# Altium schematic sheet I2C.SchDoc
size A4
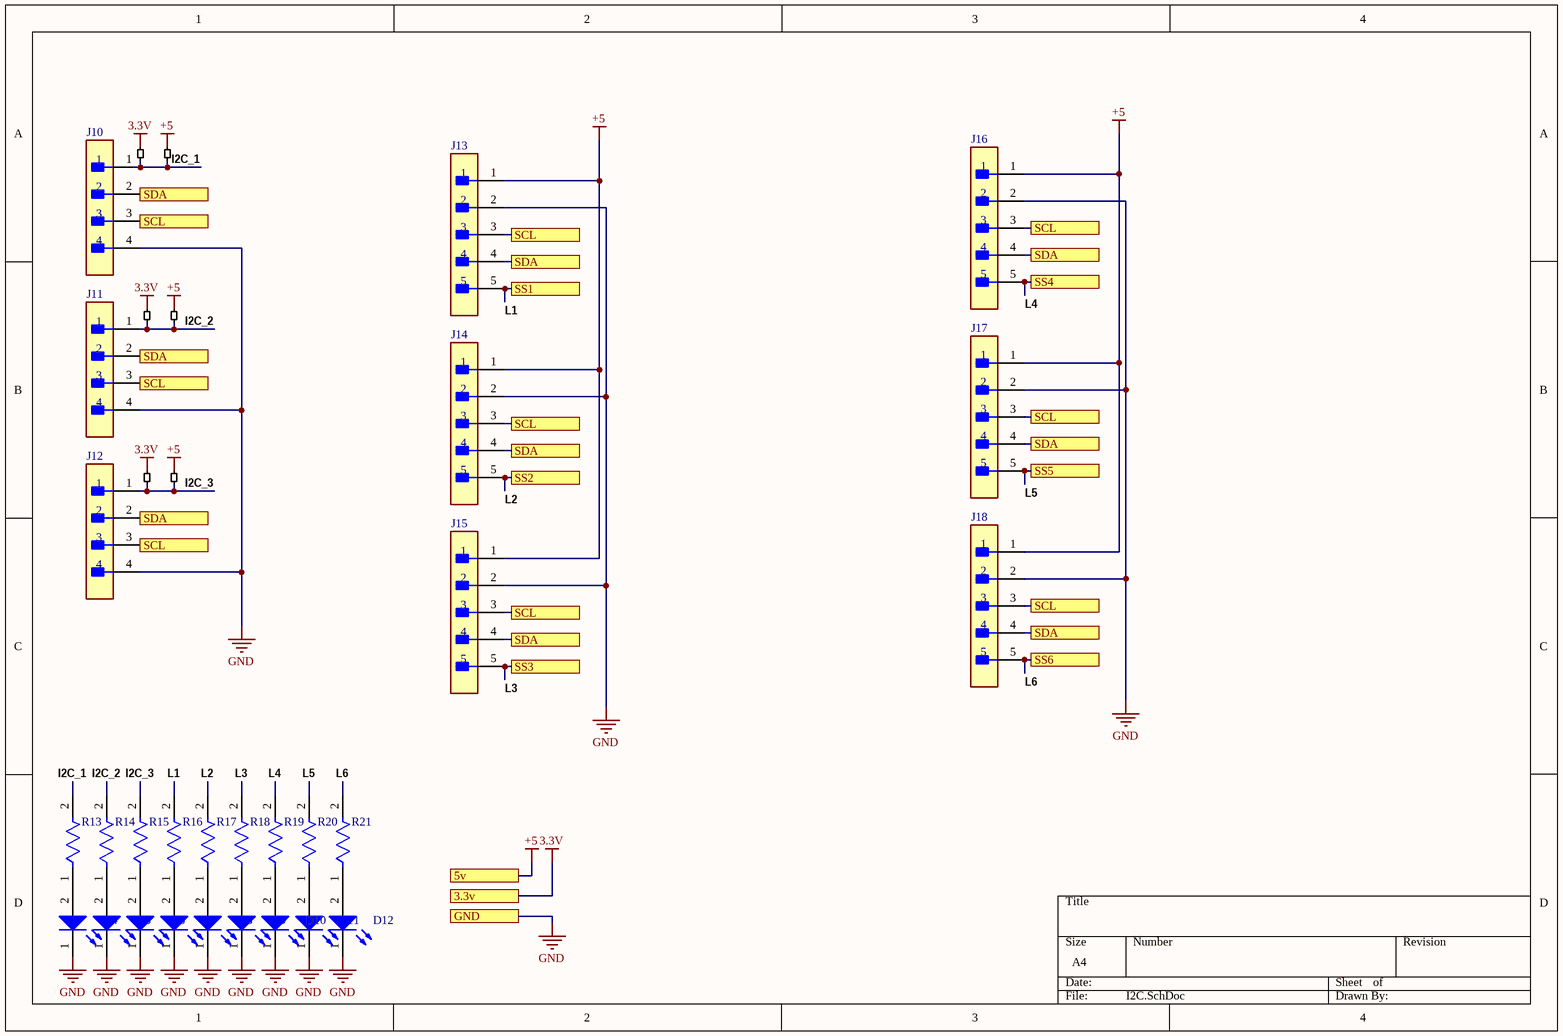
[diagram p0: I2C.SchDoc]

## Parts
D4  150080BS75000  [WL-SMCW_0805_150080xx75000]  (value not drawn)
D5  150080BS75000  [WL-SMCW_0805_150080xx75000]  (value not drawn)
D6  150080BS75000  [WL-SMCW_0805_150080xx75000]  (value not drawn)
D7  150080BS75000  [WL-SMCW_0805_150080xx75000]  (value not drawn)
D8  150080BS75000  [WL-SMCW_0805_150080xx75000]  (value not drawn)
D9  150080BS75000  [WL-SMCW_0805_150080xx75000]  (value not drawn)
D10  150080BS75000  [WL-SMCW_0805_150080xx75000]  (value not drawn)
D11  150080BS75000  [WL-SMCW_0805_150080xx75000]  (value not drawn)
D12  150080BS75000  [WL-SMCW_0805_150080xx75000]  (value not drawn)
J10  B4B-XH-A(LF)(SN)  [FP-B4B-XH-A_LF_SN-MFG]  (value not drawn)
J11  B4B-XH-A(LF)(SN)  [FP-B4B-XH-A_LF_SN-MFG]  (value not drawn)
J12  B4B-XH-A(LF)(SN)  [FP-B4B-XH-A_LF_SN-MFG]  (value not drawn)
J13  B5B-PH-K-S(LF)(SN)  [FP-B5B-PH-K-S_LF_SN-MFG]  (value not drawn)
J14  B5B-PH-K-S(LF)(SN)  [FP-B5B-PH-K-S_LF_SN-MFG]  (value not drawn)
J15  B5B-PH-K-S(LF)(SN)  [FP-B5B-PH-K-S_LF_SN-MFG]  (value not drawn)
J16  B5B-PH-K-S(LF)(SN)  [FP-B5B-PH-K-S_LF_SN-MFG]  (value not drawn)
J17  B5B-PH-K-S(LF)(SN)  [FP-B5B-PH-K-S_LF_SN-MFG]  (value not drawn)
J18  B5B-PH-K-S(LF)(SN)  [FP-B5B-PH-K-S_LF_SN-MFG]  (value not drawn)
R13  ERJ-P06F1001V  [FP-ERJP06-IPC_C]  (value not drawn)
R14  ERJ-P06F1001V  [FP-ERJP06-IPC_C]  (value not drawn)
R15  ERJ-P06F1001V  [FP-ERJP06-IPC_C]  (value not drawn)
R16  ERJ-P06F1001V  [FP-ERJP06-IPC_C]  (value not drawn)
R17  ERJ-P06F1001V  [FP-ERJP06-IPC_C]  (value not drawn)
R18  ERJ-P06F1001V  [FP-ERJP06-IPC_C]  (value not drawn)
R19  ERJ-P06F1001V  [FP-ERJP06-IPC_C]  (value not drawn)
R20  ERJ-P06F1001V  [FP-ERJP06-IPC_C]  (value not drawn)
R21  ERJ-P06F1001V  [FP-ERJP06-IPC_C]  (value not drawn)
W18  Jumper  [Jumper Mid]  (value not drawn)
W19  Jumper  [Jumper Mid]  (value not drawn)
W20  Jumper  [Jumper Mid]  (value not drawn)
W21  Jumper  [Jumper Mid]  (value not drawn)
W22  Jumper  [Jumper Mid]  (value not drawn)
W23  Jumper  [Jumper Mid]  (value not drawn)

## Ports
3.3v, 5v, GND, SCL, SDA, SS1, SS2, SS3, SS4, SS5, SS6

## Nets
3.3V: W18.2 W19.2 W20.2 ; port 3.3v
+5: J13.1 J14.1 J15.1 J16.1 J17.1 J18.1 W21.2 W22.2 W23.2 ; port 5v
GND: D4.1(K) D5.1(K) D6.1(K) D7.1(K) D8.1(K) D9.1(K) D10.1(K) D11.1(K) D12.1(K) J10.4 J11.4 J12.4 J13.2 J14.2 J15.2 J16.2 J17.2 J18.2 ; port GND
I2C_1: J10.1 R13.2 W18.1 W21.1
I2C_2: J11.1 R14.2 W19.1 W22.1
I2C_3: J12.1 R15.2 W20.1 W23.1
L1: J13.5 R16.2 ; port SS1
L2: J14.5 R17.2 ; port SS2
L3: J15.5 R18.2 ; port SS3
L4: J16.5 R19.2 ; port SS4
L5: J17.5 R20.2 ; port SS5
L6: J18.5 R21.2 ; port SS6
SCL: J10.3 J11.3 J12.3 J13.3 J14.3 J15.3 J16.3 J17.3 J18.3 ; port SCL
SDA: J10.2 J11.2 J12.2 J13.4 J14.4 J15.4 J16.4 J17.4 J18.4 ; port SDA
NetD4_2: D4.2(A) R13.1
NetD5_2: D5.2(A) R14.1
NetD6_2: D6.2(A) R15.1
NetD7_2: D7.2(A) R16.1
NetD8_2: D8.2(A) R17.1
NetD9_2: D9.2(A) R18.1
NetD10_2: D10.2(A) R19.1
NetD11_2: D11.2(A) R20.1
NetD12_2: D12.2(A) R21.1

## Library data of the parts
D4-D12 = CMP-1426-00008-6: NexarPartId: 29717779; Test Current: 20mA; Lens Style: Clear, Rectangular; Forward Current: 100mA; Power Dissipation: 105mW; Dominant Wavelength: 470nm; Reverse Voltage: 5V; Viewing Angle: 140°; Luminous Intensity: 145mcd; Color: Blue; Forward Voltage: 3.2V; Max Junction Temperature (Tj): 95°C; Peak Wavelength: 465nm; Min Operating Temperature: -40°C; Mount: Surface Mount; Case Code (Imperial): 0805; Packaging: Tape and Reel; Lead Free: Lead Free; Length: 2mm; Case/Package: 0805; Case Code (Metric): 2012; Max Operating Temperature: 85°C; Height: 700µm; RoHS: Compliant; Max Reverse Voltage (DC): 5V; REACH SVHC: Unknown; Width: 1.25mm; Wavelength: 470nm
J10-J12 = CMP-17439-000250-1: CONN HEADER VERT 4POS 2.5MM; Number of Contacts: 4; Contact Resistance: 20mR; Voltage Rating: 250V; Max Current Rating: 3A; Gender: Male; Wire/Cable Gauge: 22AWG; Mated Stacking Heights: 9.8mm; Insulation Resistance: 1GR; Orientation: Straight; Contact Type: Male Pin; Contact Finish - Mating: TIN; Series: XH; Max Voltage Rating (AC): 250V; Lead Pitch: 2.5mm; Contact Shape: Square; Insulation Color: Natural; Termination: Solder; Lead Free: Lead Free; Voltage Rating (AC): 250V; Number of Rows: 1; Flammability Rating: UL94 V-0; Number of Positions: 4; Max Operating Temperature: 85°C; Package Quantity: 500; Mount: Through Hole; REACH SVHC: No SVHC; Connector Type: Header; Insulation Material: Nylon; Fastening Type: Detent; Min Operating Temperature: -25°C; Housing Color: White; Packaging: Bulk; Contact Plating: Tin; Contact Material: Brass; Max Voltage Rating (DC): 250V; Housing Material: Polyamide; Color: Natural; Material: Polyamide; Pitch: 2.5mm; Depth: 5.75mm; Current Rating: 3A; Length: 12.4mm
J13-J18 = CMP-2000-05908-2: CONN HEADER VERT 5POS 2MM; Voltage Rating (AC): 100V; Number of Positions: 5; Contact Resistance: 20mR; Insulation Resistance: 1MR; Current Rating: 2A; Gender: Male; Mated Stacking Heights: 8mm; Series: PH; Number of Poles: 5; Width: 4.5mm; Insulation Color: Natural; Fastening Type: Detent; Flammability Rating: UL94 V-0; Mount: Through Hole; Lead Free: Lead Free; Number of Rows: 1; REACH SVHC: No SVHC; Max Voltage Rating (AC): 100V; Contact Mating Length: 0.13inch; Contact Plating: Tin; Housing Material: Polyamide; Depth: 4.5mm; Contact Type: Male Pin; Voltage Rating: 100V; Color: Natural; Housing Color: White; Lead Pitch: 2mm; Number of Contacts: 5; Orientation: Straight; Packaging: Bulk; Contact Material: Brass; Pitch: 2mm; Insulation Material: Nylon; Connector Type: Header; Contact Finish - Mating: TIN; Termination: Solder; Number of Pins: 5; Length: 11.9mm; Contact Shape: Square; Max Current Rating: 2A; Working Voltage: 100V; Min Operating Temperature: -25°C; Max Operating Temperature: 85°C; Material: Polyamide; Height: 9.4mm
R13-R21 = CMP-05422-000125-1: RES SMD 1K OHM 1% 1/2W 0805; Temperature Coefficient: 100ppm/°C; Max Power Dissipation: 500mW; Voltage Rating: 150V; Resistance: 1kR; Case Code (Metric): 2012; Max Operating Temperature: 155°C; REACH SVHC: No SVHC; Mount: Surface Mount; Military Standard: Not; Package Quantity: 5000; Series: ERJ; Height: 0.6mm; Radiation Hardening: No; Termination: Tab; Number of Terminations: 2; Length: 2mm; Resistance Tolerance: 1%; Voltage Rating (DC): 150V; Depth: 1.25mm; Construction: Rectangular; Resistor Type: Thick Film; Packaging: Tape and Reel; Contact Plating: Tin; RoHS Compliant: Yes; Features: Automotive AEC-Q200; Number of Pins: 2; Case Code (Imperial): 0805; Technology: THICK FILM; Width: 1.2mm; Case/Package: 0805; Min Operating Temperature: -55°C; Power Rating: 500mW; Tolerance: 1%